# Altium project Connector_v2h_cam.PrjPcb
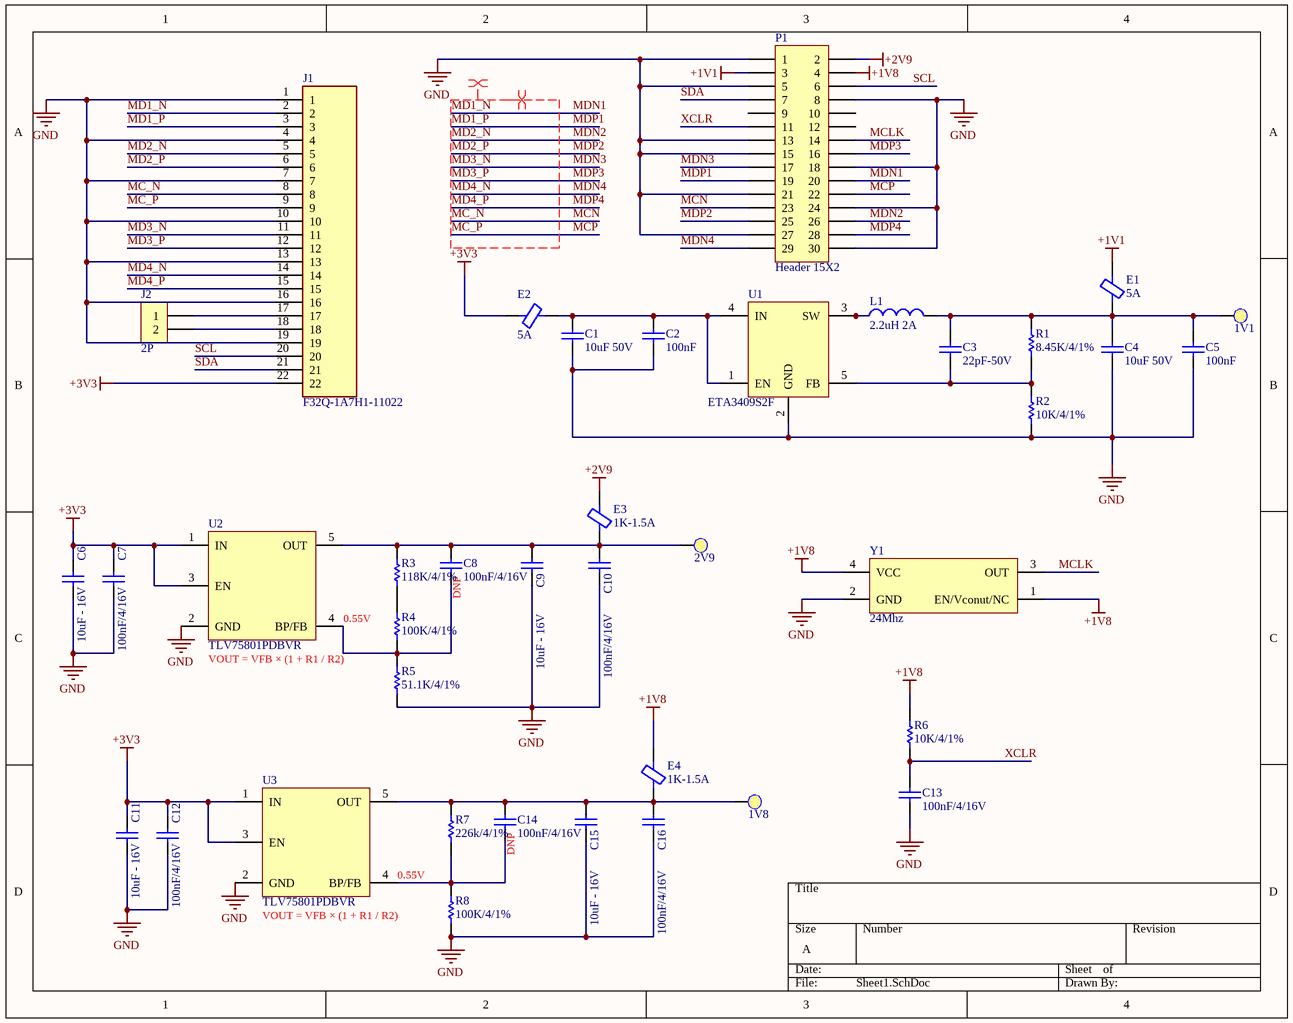
[diagram p0: Sheet1.SchDoc]
1 sheet, 39 parts. Net scope: global (net labels, ports and power ports of the same name join across sheets).
Board file: PCB1.PcbDoc

## Sheet Sheet1.SchDoc
size A; SheetNumber: 1; SheetTotal: 1

### Parts
1V1  TP  [TP-SMD]  (value not drawn)  (no BOM)
1V8  TP  [TP-SMD]  (value not drawn)  (no BOM)
2V9  TP  [TP-SMD]  (value not drawn)  (no BOM)
C1  10uF 50V  [CAPC_1206_N]
C2  100nF  [CAPC_0603_N]
C3  22pF-50V  [C0402]
C4  10uF 50V  [CAPC_1206_N]
C5  100nF  [CAPC_0603_N]
C6  10uF - 16V  [CAPC_0805_N]
C7  100nF/4/16V  [C0402]
C8  100nF/4/16V  [C0402]  (no BOM)
C9  10uF - 16V  [CAPC_0805_N]
C10  100nF/4/16V  [C0402]
C11  10uF - 16V  [CAPC_0805_N]
C12  100nF/4/16V  [C0402]
C13  100nF/4/16V  [C0402]
C14  100nF/4/16V  [C0402]
C15  10uF - 16V  [CAPC_0805_N]
C16  100nF/4/16V  [C0402]
E1  5A  [0603]
E2  5A  [0603]
E3  1K-1.5A  [0805]
E4  1K-1.5A  [0805]
J1  F32Q-1A7H1-11022  [AMPHENOL_F32Q-1A7H1-11022]
J2  2P  [JUMP-2.54-2PIN-M-TH]
L1  2.2uH 2A  [IND-3x3]
P1  Header 15X2  [HDR2X15]
R1  8.45K/4/1%  [R0402]
R2  10K/4/1%  [R0402]
R3  118K/4/1%  [R0402]
R4  100K/4/1%  [R0402]
R5  51.1K/4/1%  [R0402]
R6  10K/4/1%  [R0402]
R7  226k/4/1%  [R0402]
R8  100K/4/1%  [R0402]
U1  ETA3409S2F  [SOT-23-5]
U2  TLV75801PDBVR  [SOT-23-5]
U3  TLV75801PDBVR  [SOT-23-5]
Y1  24Mhz  [SMD3225-4P]

### Nets
+1V1: E1.2 P1.3
+1V8: E4.2 P1.4 R6.1 Y1.1(EN/Vconut/NC) Y1.4(VCC)
+2V9: E3.2 P1.2
+3V3: C6.2 C7.2 C11.2 C12.2 E2.2 J1.22 U2.1(IN) U2.3(EN) U3.1(IN) U3.3(EN)
GND: C1.1 C2.1 C4.1 C5.1 C6.1 C7.1 C9.1 C10.1 C11.1 C12.1 C13.1 C15.1 C16.1 J1.1 J1.4 J1.7 J1.10 J1.13 J1.16 J1.19 P1.1 P1.5 P1.8 P1.13 P1.15 P1.18 P1.21 P1.24 P1.27 P1.30 R2.2 R5.2 R8.2 U1.2(GND) U2.2(GND) U3.2(GND) Y1.2(GND)
MC_N: J1.8 P1.23  [also labelled MCN]
MC_P: J1.9 P1.22  [also labelled MCP]
MCLK: P1.14 Y1.3(OUT)
MD1_N: J1.2 P1.20  [also labelled MDN1]
MD1_P: J1.3 P1.19  [also labelled MDP1]
MD2_N: J1.5 P1.26  [also labelled MDN2]
MD2_P: J1.6 P1.25  [also labelled MDP2]
MD3_N: J1.11 P1.17  [also labelled MDN3]
MD3_P: J1.12 P1.16  [also labelled MDP3]
MD4_N: J1.14 P1.29  [also labelled MDN4]
MD4_P: J1.15 P1.28  [also labelled MDP4]
SCL: J1.20 P1.6
SDA: J1.21 P1.7
XCLR: C13.2 P1.11 R6.2
Net1V1_1: 1V1.1(TP) C3.2 C4.2 C5.2 E1.1 L1.2 R1.1
Net1V8_1: 1V8.1(TP) C14.2 C15.2 C16.2 E4.1 R7.1 U3.5(OUT)
Net2V9_1: 2V9.1(TP) C8.2 C9.2 C10.2 E3.1 R3.1 U2.5(OUT)
NetC1_2: C1.2 C2.2 E2.1 U1.1(EN) U1.4(IN)
NetC3_1: C3.1 R1.2 R2.1 U1.5(FB)
NetC8_1: C8.1 R4.2 R5.1 U2.4(BP/FB)
NetC14_1: C14.1 R7.2 R8.1 U3.4(BP/FB)
NetJ1_17: J1.17 J2.1
NetJ1_18: J1.18 J2.2
NetL1_1: L1.1 U1.3(SW)
NetR3_2: R3.2 R4.1

Not connected (* = marked no-connect by the designer): P1 9 10 12

### Layout directives
differential pair; differential pair class MDC: MC_N, MC_P, MD1_N, MD1_P, MD2_N, MD2_P, MD3_N, MD3_P, MD4_N, MD4_P
net class 100R: MC_N, MC_P, MD1_N, MD1_P, MD2_N, MD2_P, MD3_N, MD3_P, MD4_N, MD4_P

### Notes on the sheet
- 0.55V
- (near C8) DNP
- (near U2) VOUT = VFB × (1 + R1 / R2)
- (near C14) DNP
- (near U3) VOUT = VFB × (1 + R1 / R2)

### Library data of the parts
C1 C4 = TCC1206X5R106K500HT: 10uF ±10% 50V Ceramic Capacitor X5R 1206; Manufacture: CCTC; Partnumber: TCC1206X5R106K500HT; Value: 10uF 50V; Category: Capacitor; Mounting type: SMD; Tolerance: ±10%; Detailed Value: 10uF 50V
C2 C5 = CC0603KRX7R9BB104: 50V 100nF X7R ±10% 0603 Multilayer Ceramic Capacitors MLCC - SMD/SMT ROHS; Manufacture: Yageo; Partnumber: CC0603KRX7R9BB104; Value: 100nF; Creator: Hainv; Category: Capacitor; Mounting type: SMD; Supplier: LCSC; Tolerance: ±10%; Detailed Value: 100nF
C3 = CC0402JRNPO9BN220: 22pF ±5% 50V Ceramic Capacitor NP0 0402; Manufacture: Yageo; Partnumber: CC0402JRNPO9BN220; Value: 22pF-50V; Creator: Hainv; Category: Capacitor; Mounting type: SMD; Supplier: LCSC; Detailed Value: 22pF-50V
C6 C9 C11 C15 = C0805X5R106K160NT: CAP CER 10uF 16V X5R 0805; Manufacture: Hottech; Detailed Value: 10uF - 16V - 0805; PROJECT: KHO; Partnumber: C0805X5R106K160NT; Value: 10uF - 16V; Creator: ThangND; Category: Capacitor; Mounting type: SMD
C7 C8 C10 C12-C14 C16 = CC0402KRX7R7BB104: 16V 100nF X7R ±10% 0402 Multilayer Ceramic Capacitors MLCC - SMD/SMT ROHS; Manufacture: Yageo; Partnumber: CC0402KRX7R7BB104; Value: 100nF/4/16V; Creator: Hainv; Category: Capacitor; Mounting type: SMD; Supplier: LCSC; Tolerance: ±10%; Detailed Value: 100nF/4/16V
E1 E2 = YI160808U100-5R0T: 10mΩ ±25% 10Ω@100MHz 0603 Ferrite Beads and Chips RoHS; Manufacture: YJYCOIN; Partnumber: YI160808U100-5R0T; Value: 5A; Creator: Hainv; Category: Ferrite Bead; Mounting type: SMD; Supplier: LCSC; Detailed Value: 5A
E3 E4 = UPZ2012E102-1R5TF: FERRITE BEAD 1 KOHM 0805 1.5A; Manufacture: Sunlord; Partnumber: UPZ2012E102-1R5TF; Value: 1K-1.5A; Creator: Tunn; Category: Ferrite Bead; Mounting type: SMD; Detailed Value: 1K-1.5A
J1 = F32Q-1A7H1-11022: Flex Connector, 0.50mm Pitch, Height 2.00mm, Right angle, Slider type, ZIF, Upper contact, 22 position , Without MYLAR; MF: Amphenol ICC (FCI); SnapEDA_Link: https://www.snapeda.com/parts/F32Q-1A7H1-11022/Amphenol+FCI/view-part/?ref=snap; Package: None; Value: *; MP: F32Q-1A7H1-11022; Check_prices: https://www.snapeda.com/parts/F32Q-1A7H1-11022/Amphenol+FCI/view-part/?ref=eda
J2 = X6521WV-2x01H-C60D30: 2P 2x1P Gold Brass -40℃~+105℃ Pin Header Black 2.54mm 2.5mm 250V 2 3A 2.54mm Through Hole,P=2.54mm Headers, Male Pins RoHS; Manufacture: XKB Connection; Partnumber: X6521WV-2x01H-C60D30; Value: 2P; Creator: Hainv; Category: Connector; Mounting type: TH; Supplier: LCSC; Detailed Value: 2P
L1 = ZNR3015ST2R2M: 2A 2.2uH Magnetic Shielded Inductor ±20% 2A 60mΩ SMD,3x3mm Fixed Inductors RoHS; Manufacture: ZE; Partnumber: ZNR3015ST2R2M; Value: 2.2uH 2A; Creator: Hainv; Category: Inductor; Mounting type: SMD; Supplier: LCSC; Detailed Value: 2.2uH 2A
P1 = Header 15X2: Header, 15-Pin, Dual row; LatestRevisionDate: 17-Jul-2002; LatestRevisionNote: Re-released for DXP Platform.; Publisher: Altium Limited
R1 = RC0402FR-078K45L: 62.5mW 8.45kΩ 50V Thick Film Resistor ±100ppm/℃ ±1% 0402 Chip Resistor - Surface Mount RoHS; Manufacture: Yageo; Partnumber: RC0402FR-078K45L; Value: 8.45K/4/1%; Creator: Hainv; Category: Resistor; Mounting type: SMD; Supplier: LCSC; Detailed Value: 8.45K/4/1%
R2 R6 = RC0402FR-0710KL: 62.5mW Thick Film Resistor 50V ±100ppm/℃ ±1% 10kΩ 0402 Chip Resistor - Surface Mount ROHS; Manufacture: Yageo; Partnumber: RC0402FR-0710KL; Value: 10K/4/1%; Creator: Hainv; Category: Resistor; Mounting type: SMD; Supplier: LCSC; Tolerance: ±1%; Detailed Value: 10K/4/1%
R3 = RC0402DR-07118KL: 62.5mW 118kΩ 50V Thick Film Resistor ±100ppm/℃ ±0.5% 0402 Chip Resistor - Surface Mount RoHS; Manufacture: Yageo; Partnumber: RC0402DR-07118KL; Value: 118K/4/1%; Creator: Hainv; Category: Resistor; Mounting type: SMD; Supplier: LCSC; Detailed Value: 118K/4/1%
R4 R8 = RC0402FR-07100KL: 62.5mW Thick Film Resistor 50V ±100ppm/℃ ±1% 100kΩ 0402 Chip Resistor - Surface Mount ROHS; Manufacture: Yageo; Partnumber: RC0402FR-07100KL; Value: 100K/4/1%; Creator: Hainv; Category: Resistor; Mounting type: SMD; Supplier: LCSC; Tolerance: ±1%; Detailed Value: 100K/4/1%
R5 = RC0402FR-0751K1L: 51.1kΩ 62.5mW 50V Thick Film Resistor ±100ppm/℃ ±1% 0402 Chip Resistor - Surface Mount RoHS; Manufacture: Yageo; Partnumber: RC0402FR-0751K1L; Value: 51.1K/4/1%; Creator: Hainv; Category: Resistor; Mounting type: SMD; Supplier: LCSC; Detailed Value: 51.1K/4/1%
R7 = AC0402FR-07226KL: 226kΩ 62.5mW 50V Thick Film Resistor ±100ppm/℃ ±1% 0402 Chip Resistor - Surface Mount RoHS; Manufacture: Yageo; Partnumber: AC0402FR-07226KL; Value: 226k/4/1%; Creator: Hainv; Category: Resistor; Mounting type: SMD; Supplier: LCSC; Detailed Value: 226K/4/1%
U1 = ETA3409S2F: Buck 1MHz Adjustable 600mV~7.3V 3A SOT23-5 Voltage Regulators - DC DC Switching Regulators RoHS; Manufacture: etasolution; Partnumber: ETA3409S2F; Value: ETA3409S2F; Creator: Hainv; Category: IC; Mounting type: SMD; Supplier: LCSC; Detailed Value: ETA3409S2F
U2 U3 = TLV75801PDBVR: 500mA, low IQ, high precision, adjustable ultra-low dropout voltage regulator with enable function; Manufacture: TI; Partnumber: TLV75801PDBVR; Value: TLV75801PDBVR; Creator: Hainv; Category: IC; Mounting type: SMD; Supplier: LCSC; Detailed Value: TLV75801PDBVR
Y1 = 1631-24003-BTKEYA: 1.8V 10mA ±30ppm CMOS 24MHz SMD3225-4P Crystal Oscillators ROHS; Manufacture: Interquip; Partnumber: 1631-24003-BTKEYA; Value: 24Mhz; Creator: Hainv; Category: Crystal; Mounting type: SMD; Supplier: LCSC; Detailed Value: 24Mhz
1V1 1V8 2V9 = TP: Partnumber: TP; Value: TP; Creator: Quyen.nv; Category: Connector; Detailed Value: TP